# EAGLE design SendWeather (EAGLE 8.2.2)
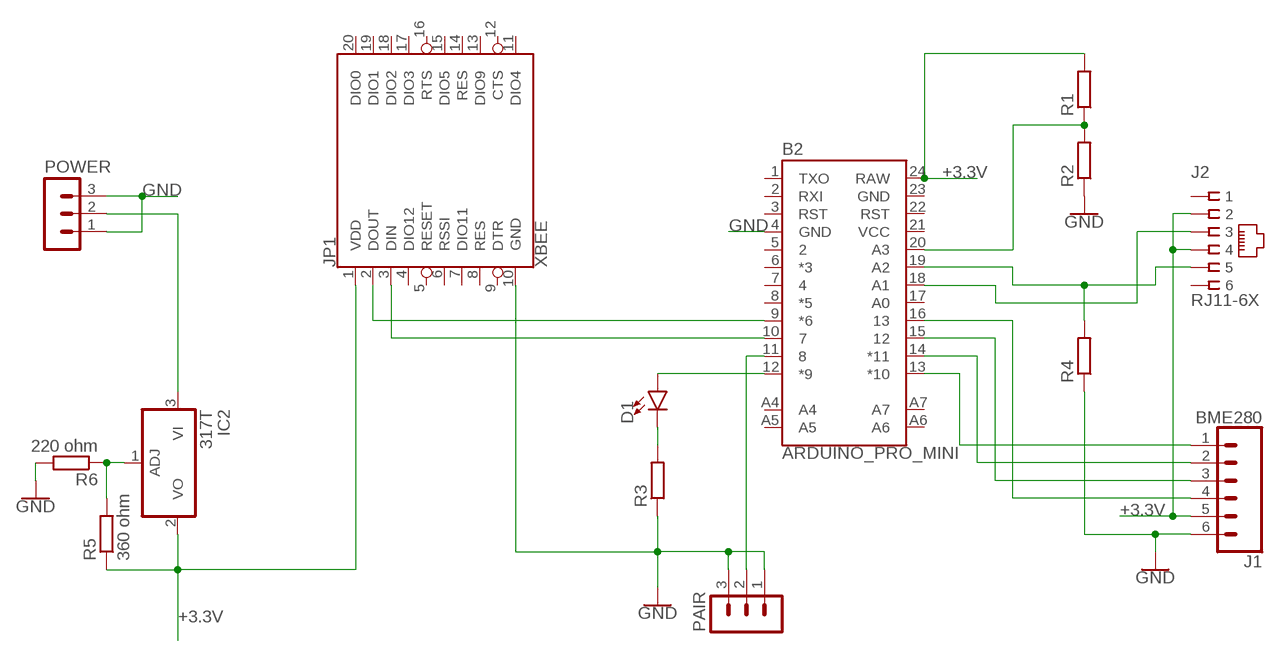
[diagram p0: schematic, sheet 1]

## Parts
B2  ARDUINO_PRO_MINI  [ARDUINO_PRO_MINI]
D1  LED3MM  [LED_3MM]
IC2  317T  [TO220H]
J1  BME280  CONN_06NO_SILK_NO_POP  [1X06_NO_SILK]
J2  RJ11-6X  [RJ11-NO_SHIELD]
JP1  XBEE  [XBEE]
PAIR  MA03-1  [MA03-1]
POWER  MA03-1  [MA03-1]
R1  R-EU_0309/12  [0309/12]
R2  R-EU_0309/12  [0309/12]
R3  R-EU_0309/12  [0309/12]
R4  R-EU_0309/12  [0309/12]
R5  360 ohm  R-EU_0309/12  [0309/12]
R6  220 ohm  R-EU_0309/12  [0309/12]

## Nets
+3.3V: B2.24(RAW) IC2.2(VO) J1.5 J2.2 J2.4 JP1.1(VDD) R1.2 R5.1
GND: B2.4(GND) J1.6 JP1.10(GND) PAIR.1 PAIR.3 POWER.1 POWER.3 R2.1 R3.1 R4.1 R6.2
N$1: B2.16 J1.4
N$2: B2.15 J1.3
N$3: B2.14(*11) J1.2
N$4: B2.12(*9) D1.A
N$5: B2.13(*10) J1.1
N$6: B2.20(A3) R1.1 R2.2
N$7: B2.18(A1) J2.3
N$8: D1.K(C) R3.2
N$9: B2.9(*6) JP1.2(DOUT)
N$10: B2.11 PAIR.2
N$12: B2.19(A2) J2.5 R4.2
N$13: IC2.1(ADJ) R5.2 R6.1
N$15: B2.10 JP1.3(DIN)
VDD: IC2.3(VI) POWER.2
Unconnected: B2.1(TXO) B2.2(RXI) B2.3(RST) B2.5 B2.6(*3) B2.7 B2.8(*5) B2.17(A0) B2.22(RST) B2.A4 B2.A5 B2.A6 B2.A7 J2.1 J2.6 JP1.4(DIO12) JP1.5(RESET) JP1.6(RSSI) JP1.7(DIO11) JP1.8(RES) JP1.9(DTR) JP1.11(DIO4) JP1.12(CTS) JP1.13(DIO9) JP1.14(RES) JP1.15(DIO5) JP1.16(RTS) JP1.17(DIO3) JP1.18(DIO2) JP1.19(DIO1) JP1.20(DIO0)

## Power pins joined to a net without a drawn wire
GND: B2.23(GND)
VDD: B2.21(VCC)

## Library data of the parts
B2 = SparkFun-arduinonano:ARDUINO_PRO_MINI: SparkFun Pro Mini Pro Mini compatible footprint. Dimensions: 0.7 x 1.3" PCB Thickness: 0.8mm SparkFun Products: 3.3V/8MHz <https://www.sparkfun.com/products/11114> 5V/16MHz <https://www.sparkfun.com/products/11113>
D1 = SparkFun-LED:LED: LED (Generic) Standard schematic elements and footprints for 5mm, 3mm, 1206, and 0603 sized LEDs. Generic LEDs with no color specified.; PROD_ID: DIO-08794
IC2 = linear:*317: Positive VOLTAGE REGULATOR
J1 = SparkFun-Connectors:CONN_06: Multi connection point. Often used as Generic Header-pin footprint for 0.1 inch spaced/style header connections On any of the 0.1 inch spaced packages, you can populate with these: Break Away Headers - Straight <https://www.sparkfun.com/products/116> (PRT-00116) Break Away Male Headers - Right Angle <https://www.sparkfun.com/products/553> (PRT-00553) Female Headers <https://www.sparkfun.com/products/115> (PRT-00115) Break Away Headers - Machine Pin <https://www.sparkfun.com/products/117> (PRT-00117) Break Away Female Headers - Swiss Machine Pin <https://www.sparkfun.com/products/743> (PRT-00743) Arduino Stackable Header - 6 Pin <https://www.sparkfun.com/products/9280> (PRT-09280) For SCREWTERMINALS and SPRING TERMINALS visit here: Screw Terimnals on SparkFun.com <https://www.sparkfun.com/search/results?term=Screw+Terminals> (5mm/3.5mm/2.54mm spacing) This device is also useful as a general connection point to wire up your design to another part of your project. Our various solder wires solder well into these plated through hole pads. Hook-Up Wire - Assortment (Stranded, 22 AWG) <https://www.sparkfun.com/products/11375> (PRT-11375) Hook-Up Wire - Assortment (Solid Core, 22 AWG) <https://www.sparkfun.com/products/11367> (PRT-11367) View the entire wire category on our website here <https://www.sparkfun.com/categories/141>
J2 = con-tycoelectronics:RJ11: CORCOM Modular RJ Jacks No Shield Source: www.tycoelectronics.com .. ENG_DS_1654001_1099_RJ_L_0507.pdf; MPN: RJ11-6X; OC_FARNELL: unknown; OC_NEWARK: 16R6089
JP1 = SparkFun-RF:XBEE: Digi XBee and XBee Pro XBees are tiny blue chips that can communicate wirelessly with each other. They can do simple things, like replacing a couple of wires in serial communication, which is nice when you want to make a remote for your paintball vehicle. SparkFun Products SparkFun XBee Buying Guide <https://www.sparkfun.com/pages/xbee_guide> SparkFun XBee Explorer USB <https://www.sparkfun.com/products/11812> (WRL-11812) Breakout Board for XBee Module <https://www.sparkfun.com/products/8276> (WRL-8276) SparkFun XBee Explorer Regulated <https://www.sparkfun.com/products/11373> (WRL-11373) SparkFun XBee Explorer Dongle <https://www.sparkfun.com/products/11697> (WRL-11697) SparkFun XBee Shield <https://www.sparkfun.com/products/12847> (WRL-12847) SparkFun XBee Explorer Serial <https://www.sparkfun.com/products/13225> (WRL-13225)
PAIR POWER = con-lstb:MA03-1: PIN HEADER; OC_FARNELL: unknown; OC_NEWARK: unknown
R1-R6 = resistor:R-EU_: RESISTOR, European symbol

## Board
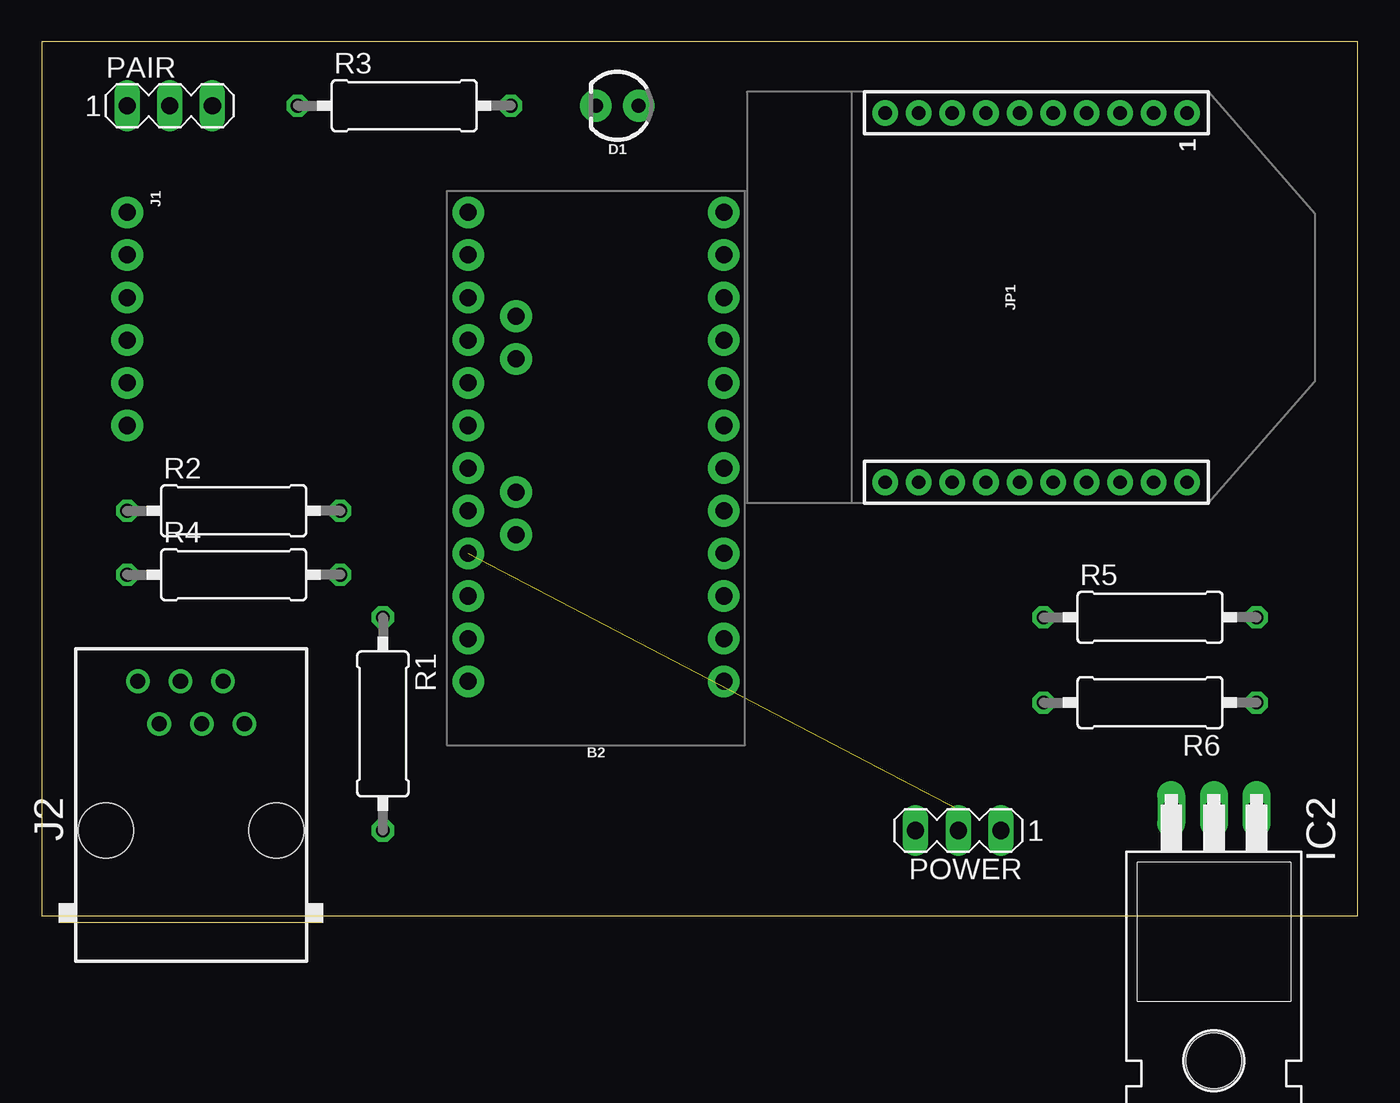
[diagram p1: board, top side]
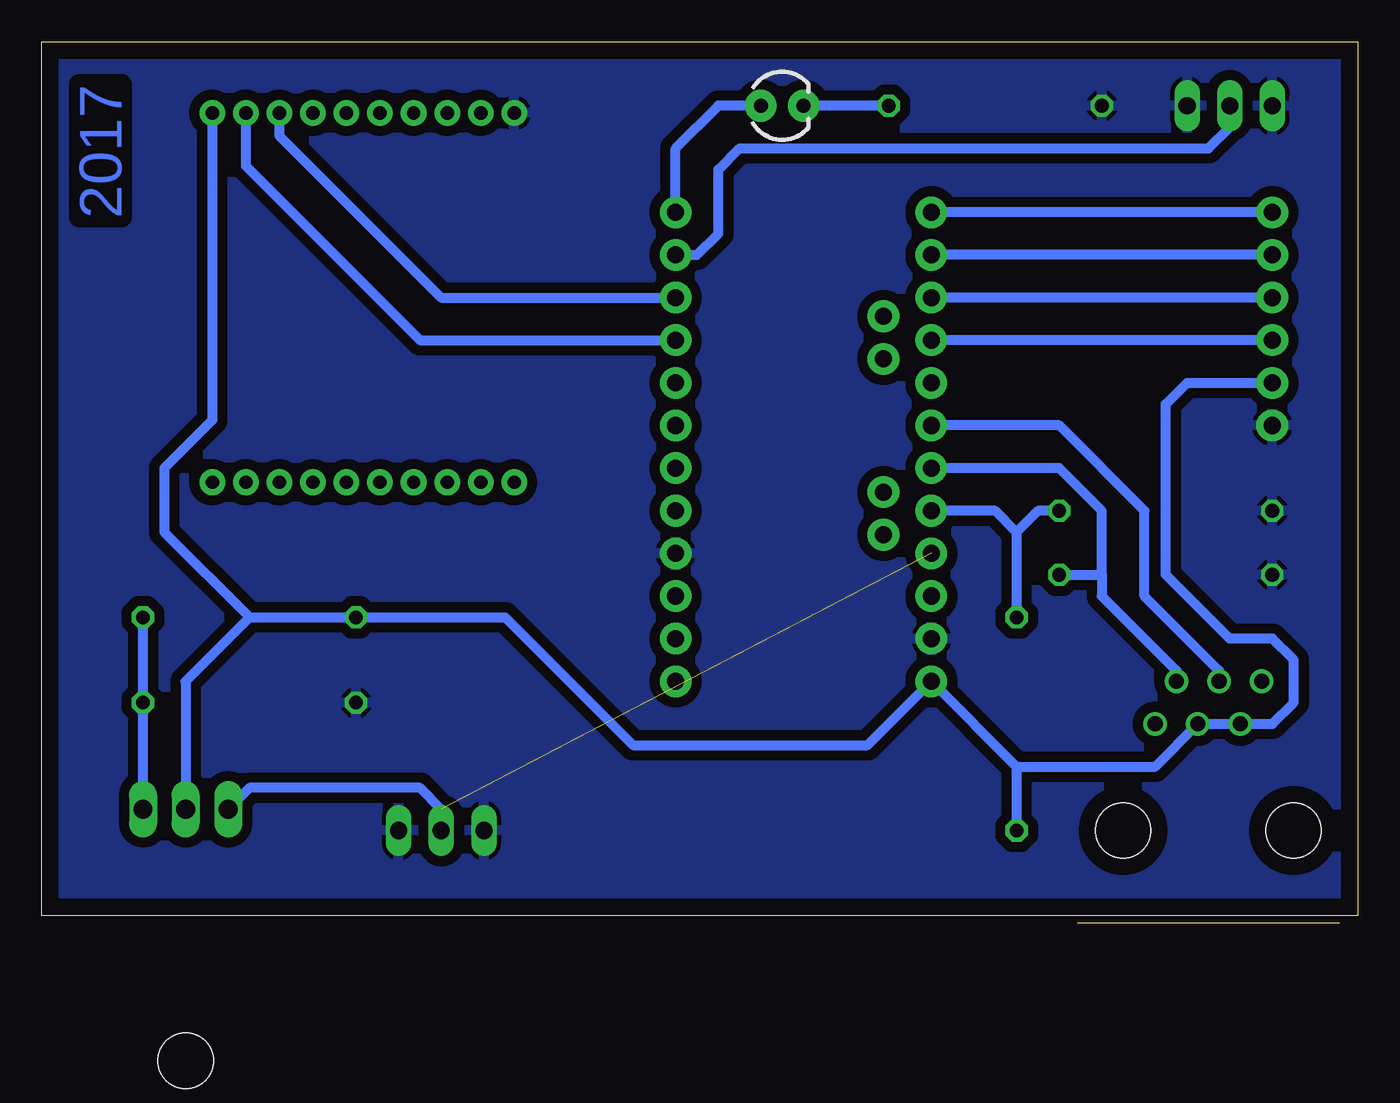
[diagram p2: board, bottom side, seen from below]

Size 78.41 x 52.06 mm. Coordinates in mm from the lower left corner, seen from the top.
Outline: 0,0 78.41,0 78.41,52.06 0,52.06 0,0
Copper layers (1*16): Top 0.035mm / dielectric 1.5mm / Bottom 0.035mm
Design rules "default": minimum track width 6mil, minimum drill 0.35mm, track to track 6mil, track to pad 6mil, pad to pad 6mil, via to via 6mil, smd to smd 6mil, copper to edge 40mil, drill to drill 6mil, minimum pad ring 10mil, minimum via ring 8mil, stop-mask expansion 4mil, vias tented up to drill 0mil, thermal gap 10mil

### Footprints (pad centres in the part's own frame; a part is rotated, then mirrored left to right if it is on the bottom)
ARDUINO_PRO_MINI = drill 1.016 pad 1.88: 1 -7.62,12.7; 2 -7.62,10.16; 3 -7.62,7.62; 4 -7.62,5.08; 5 -7.62,2.54; 6 -7.62,0; 7 -7.62,-2.54; 8 -7.62,-5.08; 9 -7.62,-7.62; 10 -7.62,-10.16; 11 -7.62,-12.7; 12 -7.62,-15.24; 13 7.62,-15.24; 14 7.62,-12.7; 15 7.62,-10.16; 16 7.62,-7.62; 17 7.62,-5.08; 18 7.62,-2.54; 19 7.62,0; 20 7.62,2.54; 21 7.62,5.08; 22 7.62,7.62; 23 7.62,10.16; 24 7.62,12.7; A4 4.763,1.429; A5 4.763,3.969; A6 4.763,-9.049; A7 4.763,-6.509
LED_3MM = drill 0.813 pad 1.88: A -1.27,0; K 1.27,0
TO220H = drill 1.118 long: 1 -2.54,-10.16; 2 0,-10.16; 3 2.54,-10.16 | hole 3.302: 0,4.826
1X06_NO_SILK = drill 1.016 pad 1.88: 1 0,0; 2 2.54,0; 3 5.08,0; 4 7.62,0; 5 10.16,0; 6 12.7,0
RJ11-NO_SHIELD = drill 0.9 pad 1.4: 1 -3.175,8.89; 2 -1.905,6.35; 3 -0.635,8.89; 4 0.635,6.35; 5 1.905,8.89; 6 3.175,6.35 | hole 3.251: -5.08,0; 5.08,0
XBEE = drill 0.8 pad 1.524: 1 -11,20; 2 -11,18; 3 -11,16; 4 -11,14; 5 -11,12; 6 -11,10; 7 -11,8; 8 -11,6; 9 -11,4; 10 -11,2; 11 11,2; 12 11,4; 13 11,6; 14 11,8; 15 11,10; 16 11,12; 17 11,14; 18 11,16; 19 11,18; 20 11,20
MA03-1 = drill 1.016 long: 1 -2.54,0; 2 0,0; 3 2.54,0
0309/12 = drill 0.813 octagon: 1 -6.35,0; 2 6.35,0

### Placement (x,y rotation side)
B2  33.02,26.67 180 top
D1  34.29,48.26 180 top
IC2  69.85,-3.81 180 top
J1  5.08,41.91 270 top
J2  8.89,5.08 0 top
JP1  48.26,36.83 270 top
PAIR  7.62,48.26 0 top
POWER  54.61,5.08 180 top
R1  20.32,11.43 270 top
R2  11.43,24.13 0 top
R3  21.59,48.26 0 top
R4  11.43,20.32 0 top
R5  66.04,17.78 0 top
R6  66.04,12.7 180 top

### Tracks (layer width: path | path; a pad name or v marks a point on that pad's centre or on a via)
+3.3V
  Bottom 0.61: 66.04,17.78 R5.1 50.8,17.78 43.18,10.16 29.21,10.16 B2.24 20.32,8.89 | 66.04,17.78 69.85,13.97 IC2.2 | 20.32,8.89 12.06,8.89 J2.4 J2.2 5.08,11.43 3.81,12.7 3.81,15.24 5.08,16.51 7.62,16.51 11.43,20.32 11.43,30.48 10.16,31.75 J1.5 | 20.32,8.89 R1.2 | JP1.1 68.26,29.53 71.12,26.67 71.12,22.86 66.04,17.78
GND
  pour Bottom (isolate 0.61): 0,52.07 78.74,52.07 78.74,0 0,0
N$1
  Bottom 0.61: J1.4 B2.16
N$2
  Bottom 0.61: J1.3 B2.15
N$3
  Bottom 0.61: J1.2 B2.14
N$4
  Bottom 0.61: B2.12 40.64,45.72 38.1,48.26 D1.A
N$5
  Bottom 0.61: J1.1 B2.13
N$6
  Bottom 0.61: 20.32,22.86 R1.1 | 20.32,22.86 21.59,24.13 B2.20 | R2.2 19.05,24.13 20.32,22.86
N$7
  Bottom 0.61: J2.3 8.25,14.61 12.7,19.05 12.7,24.13 17.78,29.21 B2.18
N$8
  Bottom 0.61: R3.2 D1.K
N$9
  Bottom 0.61: JP1.2 66.26,44.67 55.88,34.29 B2.9
N$10
  Bottom 0.61: B2.11 39.37,39.37 38.1,40.64 38.1,44.45 36.83,45.72 8.89,45.72 7.62,46.99 PAIR.2
N$12
  Bottom 0.61: J2.5 10.8,14.61 15.24,19.05 15.24,20.39 | 15.24,20.39 15.24,24.13 17.78,26.67 B2.19 | R4.2 15.31,20.32 15.24,20.39
N$13
  Bottom 0.61: R5.2 R6.1 IC2.1
N$15
  Bottom 0.61: JP1.3 64.26,46.48 54.61,36.83 B2.10
VDD  (1 unrouted)
  Bottom 0.61: POWER.2 54.61,6.35 55.88,7.62 66.04,7.62 IC2.3

### Text on the board
Bottom: 2017